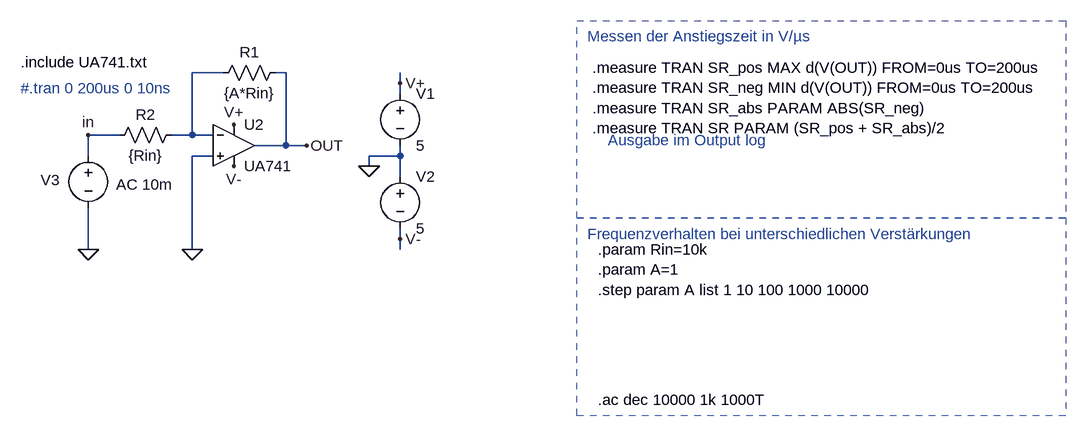
[diagram p0: schematic OPV741_inv.asc]
OPV741_inv.asc, the LTspice schematic file:
Version 4.1
SHEET 1 1524 680
WIRE 144 -16 96 -16
WIRE 240 -16 224 -16
WIRE 416 0 416 -16
WIRE 416 16 416 0
WIRE -16 80 -64 80
WIRE 96 80 96 -16
WIRE 96 80 64 80
WIRE 128 80 96 80
WIRE 240 96 240 -16
WIRE 240 96 192 96
WIRE 272 96 240 96
WIRE -64 112 -64 80
WIRE 128 112 96 112
WIRE 416 112 416 96
WIRE 416 112 368 112
WIRE 368 128 368 112
WIRE 416 144 416 112
WIRE 416 240 416 224
WIRE -64 256 -64 192
WIRE 96 256 96 112
WIRE 416 256 416 240
FLAG 368 128 0
FLAG 416 0 V+
FLAG 416 240 V-
FLAG 272 96 OUT
FLAG 160 64 V+
FLAG 160 128 V-
FLAG 96 256 0
FLAG -64 256 0
FLAG -64 80 in
SYMBOL voltage 416 0 R0
WINDOW 123 0 0 Left 2
WINDOW 39 0 0 Left 2
SYMATTR InstName V1
SYMATTR Value 5
SYMBOL voltage 416 128 R0
WINDOW 123 0 0 Left 2
WINDOW 39 0 0 Left 2
SYMATTR InstName V2
SYMATTR Value 5
SYMBOL Opamps\\opamp2 160 32 R0
SYMATTR InstName U2
SYMATTR Value UA741
SYMBOL res 240 -32 R90
WINDOW 0 0 56 VBottom 2
WINDOW 3 32 56 VTop 2
SYMATTR InstName R1
SYMATTR Value {A*Rin}
SYMBOL res 80 64 R90
WINDOW 0 0 56 VBottom 2
WINDOW 3 32 56 VTop 2
SYMATTR InstName R2
SYMATTR Value {Rin}
SYMBOL voltage -64 96 R0
WINDOW 123 43 60 Left 2
WINDOW 39 0 0 Left 2
WINDOW 3 -343 121 Left 2
WINDOW 0 -73 53 Left 2
SYMATTR Value2 AC 10m
SYMATTR Value ""
SYMATTR InstName V3
TEXT -168 -32 Left 2 !.include UA741.txt
TEXT -168 8 Left 2 ;#.tran 0 200us 0 10ns
TEXT 712 -24 Left 2 !.measure TRAN SR_pos MAX d(V(OUT)) FROM=0us TO=200us\n.measure TRAN SR_neg MIN d(V(OUT)) FROM=0us TO=200us\n.measure TRAN SR_abs PARAM ABS(SR_neg)\n.measure TRAN SR PARAM (SR_pos + SR_abs)/2
TEXT 704 -72 Left 2 ;Messen der Anstiegszeit in V/µs
TEXT 736 88 Left 2 ;Ausgabe im Output log
TEXT 720 488 Left 2 !.ac dec 10000 1k 1000T
TEXT 720 256 Left 2 !.param Rin=10k\n.param A=1\n.step param A list 1 10 100 1000 10000
TEXT 704 232 Left 2 ;Frequenzverhalten bei unterschiedlichen Verstärkungen
RECTANGLE Normal 1440 512 688 208 2
RECTANGLE Normal 1440 208 688 -96 2

The netlist it stands for:
* OPV741_inv.asc
V1 V+ 0 5
V2 0 V- 5
X§U2 0 N001 V+ V- OUT UA741  ; pins In+ In- V+ V- OUT
R1 OUT N001 {A*Rin}
R2 N001 in {Rin}
V3 in 0 AC 10m
.include UA741.txt
* #.tran 0 200us 0 10ns
.measure TRAN SR_pos MAX d(V(OUT)) FROM=0us TO=200us
.measure TRAN SR_neg MIN d(V(OUT)) FROM=0us TO=200us
.measure TRAN SR_abs PARAM ABS(SR_neg)
.measure TRAN SR PARAM (SR_pos + SR_abs)/2
* Messen der Anstiegszeit in V/µs
* Ausgabe im Output log
.ac dec 10000 1k 1000T
.param Rin=10k
.param A=1
.step param A list 1 10 100 1000 10000
* Frequenzverhalten bei unterschiedlichen Verstärkungen
.backanno
.end